# Altium schematic sheet measurment_synth.SchDoc
size A4; SheetNumber: 4; SheetTotal: 7
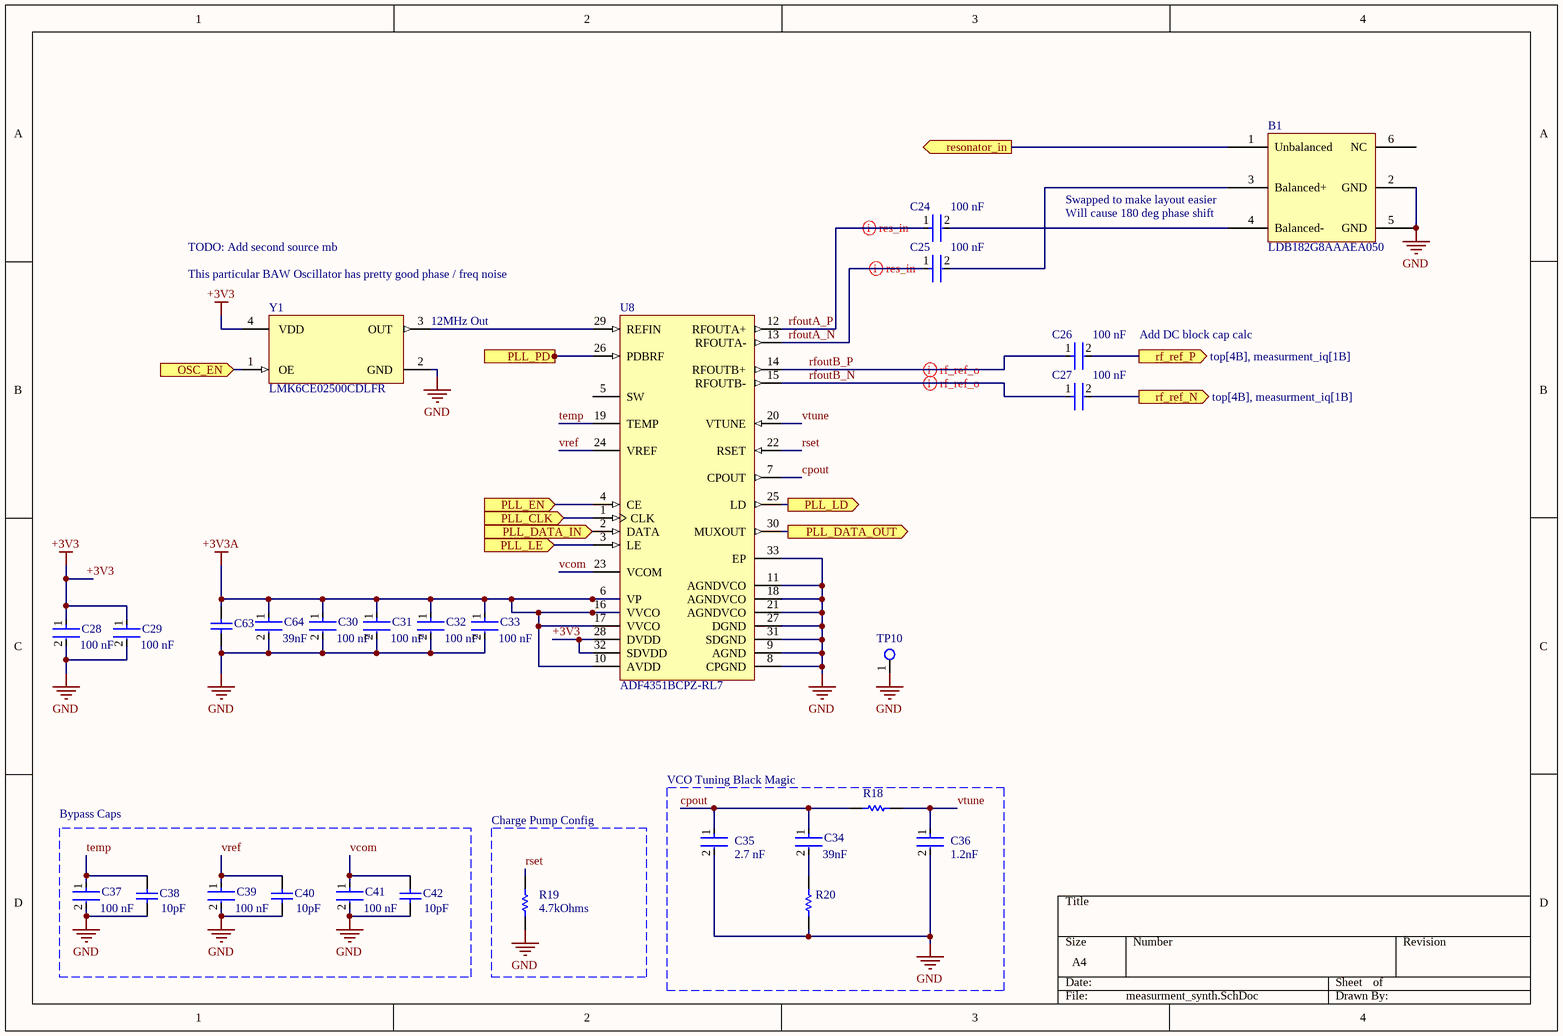
[diagram p0: measurment_synth.SchDoc]

## Parts
B1  LDB182G8AAAEA050  [Balum]
C24  Capacitance: 100 nF  [FP-CC0603-DA-MFG]  (hidden comment: CC0603KRX7R7BB104)
C25  Capacitance: 100 nF  [FP-CC0603-DA-MFG]  (hidden comment: CC0603KRX7R7BB104)
C26  Capacitance: 100 nF  [FP-CC0603-DA-MFG]  (hidden comment: CC0603KRX7R7BB104)
C27  Capacitance: 100 nF  [FP-CC0603-DA-MFG]  (hidden comment: CC0603KRX7R7BB104)
C28  Capacitance: 100 nF  [FP-CC0603-DA-MFG]  (hidden comment: CC0603KRX7R7BB104)
C29  Capacitance: 100 nF  [FP-CC0603-DA-MFG]  (hidden comment: CC0603KRX7R7BB104)
C30  Capacitance: 100 nF  [FP-CC0603-DA-MFG]  (hidden comment: CC0603KRX7R7BB104)
C31  Capacitance: 100 nF  [FP-CC0603-DA-MFG]  (hidden comment: CC0603KRX7R7BB104)
C32  Capacitance: 100 nF  [FP-CC0603-DA-MFG]  (hidden comment: CC0603KRX7R7BB104)
C33  Capacitance: 100 nF  [FP-CC0603-DA-MFG]  (hidden comment: CC0603KRX7R7BB104)
C34  Capacitance: 39nF  [FP-GCM155-0_05-IPC_B]  (hidden comment: GCM155R71C393KA37D)
C35  Capacitance: 2.7 nF  [FP-CC0402-MFG]  (hidden comment: CC0402KPX7R9BB272)
C36  Capacitance: 1.2nF  [FP-GCM188-0_1-IPC_A]  (hidden comment: GCM1885C1H122JA16J)
C37  Capacitance: 100 nF  [FP-CC0603-DA-MFG]  (hidden comment: CC0603KRX7R7BB104)
C38  Capacitance: 10pF  [CAPC1005X55X25ML05T05]  (hidden comment: CC0402JRNPO9BN100)
C39  Capacitance: 100 nF  [FP-CC0603-DA-MFG]  (hidden comment: CC0603KRX7R7BB104)
C40  Capacitance: 10pF  [CAPC1005X55X25ML05T05]  (hidden comment: CC0402JRNPO9BN100)
C41  Capacitance: 100 nF  [FP-CC0603-DA-MFG]  (hidden comment: CC0603KRX7R7BB104)
C42  Capacitance: 10pF  [CAPC1005X55X25ML05T05]  (hidden comment: CC0402JRNPO9BN100)
C63  GRM1555C1H270JA01D  [CAPC1005X55X25LL05T10]  (value not drawn)
C64  Capacitance: 39nF  [FP-GCM155-0_05-IPC_B]  (hidden comment: GCM155R71C393KA37D)
R18  RC0402JR-07680RL  [RESC1005X40X25LL05T10]  (value not drawn)
R19  Resistance: 4.7kOhms  [RESC1608X55X25LL10T15]  (hidden comment: RC0603FR-074K7L)
R20  RC0603JR-07360RL  [RESC1608X55X25ML10T15]  (value not drawn)
TP10  Test Point  [test_point]  (value not drawn)
U8  ADF4351BCPZ-RL7  [ADI-CP-32-2_L]
Y1  LMK6CE02500CDLFR  [DLF0004A_MFG]

## Blocks framed on the sheet
Bypass Caps: C37-C42
Charge Pump Config: R19
VCO Tuning Black Magic: C34-C36 R18 R20

## Ports
OSC_EN (in, see top[3B], mcu[3B]), PLL_CLK (in, see top[3B], mcu[3C]), PLL_DATA_IN (in, see top[3B], mcu[3C]), PLL_DATA_OUT (out, see top[3B], mcu[3C]), PLL_EN (in, see top[3B], mcu[3C]), PLL_LD (out, see top[3B], mcu[3C]), PLL_LE (in, see top[3B], mcu[3C]), PLL_PD (in, see top[3B], mcu[3C]), resonator_in (out, see top[4B]), rf_ref_N (out, see top[4B], measurment_iq[1B]), rf_ref_P (out, see top[4B], measurment_iq[1B])

## Nets
+3V3: C28.1 C29.1 U8.28(DVDD) U8.32(SDVDD) Y1.4(VDD)
+3V3A: C30.1 C31.1 C32.1 C33.1 C63.2 C64.1 U8.6(VP) U8.10(AVDD) U8.16(VVCO) U8.17(VVCO)
GND: B1.2(GND) B1.5(GND) C28.2 C29.2 C30.2 C31.2 C32.2 C33.2 C35.2 C36.2 C37.2 C38.1 C39.2 C40.1 C41.2 C42.1 C63.1 C64.2 R19.1 R20.1 TP10.1 U8.8(CPGND) U8.9(AGND) U8.11(AGNDVCO) U8.18(AGNDVCO) U8.21(AGNDVCO) U8.27(DGND) U8.31(SDGND) U8.33(EP) Y1.2(GND)
cpout: C34.1 C35.1 R18.1 U8.7(CPOUT)
OSC_EN: Y1.1(OE) ; port OSC_EN
PLL_CLK: U8.1(CLK) ; port PLL_CLK
PLL_DATA_IN: U8.2(DATA) ; port PLL_DATA_IN
PLL_DATA_OUT: U8.30(MUXOUT) ; port PLL_DATA_OUT
PLL_EN: U8.4(CE) ; port PLL_EN
PLL_LD: U8.25(LD) ; port PLL_LD
PLL_LE: U8.3(LE) ; port PLL_LE
PLL_PD: U8.26(PDBRF) ; port PLL_PD
resonator_in: B1.1(Unbalanced) ; port resonator_in
rf_ref_N: C27.2 ; port rf_ref_N
rf_ref_P: C26.2 ; port rf_ref_P
rfoutA_N: C25.1 U8.13(RFOUTA-)
rfoutA_P: C24.1 U8.12(RFOUTA+)
rfoutB_N: C27.1 U8.15(RFOUTB-)
rfoutB_P: C26.1 U8.14(RFOUTB+)
rset: R19.2 U8.22(RSET)
temp: C37.1 C38.2 U8.19(TEMP)
vcom: C41.1 C42.2 U8.23(VCOM)
vref: C39.1 C40.2 U8.24(VREF)
vtune: C36.1 R18.2 U8.20(VTUNE)
NetB1_3: B1.3(Balanced+) C25.2
NetB1_4: B1.4(Balanced-) C24.2
NetC34_2: C34.2 R20.2
NetU8_29: U8.29(REFIN) Y1.3(OUT)

Not connected (* = marked no-connect by the designer): B1 6(NC); U8 5(SW)

## Layout directives
differential pair: rfoutA_N, rfoutA_P, rfoutB_N, rfoutB_P

## Notes on the sheet
- TODO: Add second source mb
- (near B1) Swapped to make layout easier
- (near B1) Will cause 180 deg phase shift
- This particular BAW Oscillator has pretty good phase / freq noise
- (near Y1) 12MHz Out
- Add DC block cap calc

## Library data of the parts
C24-C33 C37 C39 C41 = CMP-2000-05002-2: CAP CER 0.1UF 16V X7R 0603; Manufacturer: YAGEO; Tolerance: 0.1; Value: 100 nF; Temperature Coefficient: 15%; Material: Ceramic; Voltage Rating: 16 V; Package: CC0603-DA; ComponentLink2Description: Datasheet; Octopart: https://octopart.com/cc0603krx7r7bb104-yageo-192941; Temperature Range High: +125°C; Digikey Description: CAP CER 0.1UF 16V X7R 0603; Voltage: 16 V; Device Class L2: Capacitors; Height: 0.9mm; Temperature: -55°C to +125°C; Manufacturer Part Number: CC0603KRX7R7BB104; Device Class L1: Passive Components; Device Class L3: Ceramic Capacitors; ComponentLink2URL: http://www.yageo.com/documents/recent/UPY-GPHC_X7R_6.3V-to-50V_18.pdf; Footprint Url: http://www.yageo.com/exep/pages/download/literatures/UPY-C_GEN_24.pdf; RoHS: TRUE; Temperature Range Low: -55°C; Temperature Characteristic: X7R; Lead Free: Yes; Category: Cap; Mouser Description: Multilayer Ceramic Capacitor, CC Series, 0.1 - F, - 10%, X7R, 16 V, 0603 [1608 Metric]; Automotive: No
C34 C64 = CMP-06035-054841-1: Ceramic Capacitor for Automotive 39nF ±10% 16VDC X7R 0402 Paper T/R; Voltage Rating: 16V; Max Operating Temperature: 125°C; Case Code (Imperial): 0402; Mount: Surface Mount; Packaging: Cut Tape; Tolerance: 10%; Min Operating Temperature: -55°C; Ratings: AEC-Q200; Case Code (Metric): 1005; Case/Package: 0402
C35 = CMP-03422-000661-1: CC0402 2.7 nF X7R 10.00% 50 V; Manufacturer: YAGEO; Material: Ceramic; Automotive Grade: NA; Voltage Rating: 50 V; Value: 2.7 nF; Temperature Coefficient: 30ppm/°C; Tolerance: 0.1; Temperature Range Low: -55°C; Manufacturer Part Number: CC0402KPX7R9BB272; Temperature Range High: +125°C; Package: CC0402; Temperature: -55°C to +125°C; ComponentLink2Description: Datasheet; Temperature Characteristic: X7R; Lead Free: Yes; Footprint Url: http://www.yageo.com/exep/pages/download/literatures/UPY-C_GEN_24.pdf; Device Class L3: Ceramic Capacitors; RoHS: TRUE; Automotive: No; Category: Cap; Device Class L2: Capacitors; ComponentLink2URL: http://www.yageo.com/documents/recent/UPY-GP_NP0_16V-to-50V_16.pdf; Device Class L1: Passive Components; Octopart: https://octopart.com/cc0402kpx7r9bb272-yageo-84795372; Height: 0.55mm; Ipc Land Pattern Name: CAPC10050X50
C36 = CMP-06035-017544-1: Ceramic Capacitor for Automotive 1.2nF  ±5% 50VDC C0G 0603 Paper T/R; Voltage Rating: 50V; Ratings: AEC-Q200; Dielectric: C0G; Width: 0.031inch; Max Operating Temperature: 125°C; Mount: Surface Mount; Height: 0.8mm; Min Operating Temperature: -55°C; Packaging: Tape and Reel; Thickness: 0.035inch; Case/Package: 0603; Package Quantity: 10000; Weight: 0.000222oz; Case Code (Metric): 1608; Tolerance: 5%; Case Code (Imperial): 0603; Voltage Rating (DC): 50V; Termination: SMD/SMT; Length: 0.063inch
C38 C40 C42 = CMP-2100-03589-1: Chip Capacitor, 10 pF, +/- 5%, 50 V, -55 to 125 degC, 0402 (1005 Metric), RoHS, Tape and Reel; Manufacturer: Yageo; Insulation Resistance: 100GR; Voltage Rating (DC): 50V; Dielectric Material: Ceramic; Temperature Coefficient: 30ppm/degC; Dielectric: C0G; Termination: SMD/SMT; Package Reference: 0402; Lead Free: LeadFree; Composition: Ceramic; Tolerance: 5%; Case Code (Metric): 1005; Voltage Rating: 50V; Packaging: TapeandReel; Manufacturer URL: http://www.yageo.com/; REACH SVHC: NoSVHC; Max Operating Temperature: 125degC; Length: 1mm; Mount: SurfaceMount; Depth: 0.5mm; Min Operating Temperature: -55degC; Number of Pins: 2; Width: 0.02inch; Datasheet Version: Rev. 14, 07/2016; Package Quantity: 1; Datasheet URL: http://www.yageo.com/documents/recent/UPY-GP_NP0_16V-to-50V_14.pdf; Case Code (Imperial): 0402; RoHSCompliant: True; Radiation Hardening: No; Height: 0.5mm; Case/Package: 0402; Thickness: 0.022inch; Package Description: 2-Pin Surface Mount Device, Body 1 x 0.5 mm; Voltage: 50V
C63 = CMP-2008-03917-1: Manufacturer: Murata; Part Number: GRM1555C1H270JA01D
R18 = CMP-2002-08032-1: Manufacturer: Yageo / Phycomp; Part Number: RC0402JR-07680RL
R19 = CMP-2000-06942-1: Chip Resistor, 4.7 KOhm, +/- 1%, 0.1 W, -55 to 155 degC, 0603 (1608 Metric), RoHS, Tape and Reel; Manufacturer: Yageo; Power Rating: 100mW; Temperature Coefficient: 100PPM/C; Voltage Rating: 50V; Package Reference: 0603; Series: RC; Datasheet Version: Rev. 7, 05/2017; Packaging: Reel; Termination Style: SMD/SMT; Datasheet URL: http://www.yageo.com/documents/recent/PYu-RC_Group_51_RoHS_L_7.pdf; Manufacturer URL: http://www.yageo.com/; Package Description: 2-Pin Surface Mount Device, Body 1.6 x 0.8 mm; Case Code - mm: 1608; Case Code - in: 0603; Mounting Technology: SurfaceMount; Operating Temperature Range: -55Cto+155C; Tolerance: 1%; Product: ThickFilmResistorsGeneralPurpose
R20 = CMP-2000-04266-1: Manufacturer: Yageo; Part Number: RC0603JR-07360RL
U8 = CMP-0287-00015-1: Wideband Synthesizer with Integrated VCO, CP-32-2, Pb-Free, 1500 Reel; Max RF Input (MHz): 4.4GHz; RF Prescalers: 4/5,8/9; Max REFin (MHz): 250MHz; Frequency Range: 35MHz-4.4GHz; Norm Phase Noise (dBc/Hz): -221dBc; Supply Current: 110mA; Single/Dual: Single; PackageVersion: Jan-2005; ComponentLink3URL: http://www.analog.com/static/imported-files/packages/414143737956480539664569CP_32_2.pdf; PackageReference: CP-32-2; ComponentLink2URL: http://www.analog.com/static/imported-files/data_sheets/ADF4351.pdf; ComponentLink1URL: www.analog.com; ComponentLink1Description: Manufacturer URL; ComponentLink2Description: Datasheet; ComponentLink3Description: Package Specification; PackageDescription: 32-Lead Lead Frame Chip Scale Package [LFCSP_VQ]; DatasheetVersion: Rev. Pr D; Code_JEDEC: MO-220-VHHD-2
Y1 = CMP-00370-144810711-1: "LOW-JITTER, HIGH-PERFORMANCE, BU" 25 MHz LVCMOS Oscillator 1.8V Enable/Disable 4-VDFN; Manufacturer Lifecycle Status: ACTIVE; Load Capacitance: 30pF; Frequency: 25MHz; Max Junction Temperature (Tj): 125°C; Max Supply Voltage: 1.9V; Min Supply Voltage: 1.7V; Height: 1mm; Min Operating Temperature: -40°C; HelpURL: https://www.ti.com/lit/ds/symlink/lmk6c.pdf; ComponentLink1URL: http://ti.com; Number of Pins: 4; ComponentLink2Description: Datasheet URL; ComponentLink2URL: https://www.ti.com/lit/ds/symlink/lmk6c.pdf; Max Operating Temperature: 105°C; Thickness: 900µm; Ambient Temperature Range High: 105°C; Length: 2.5mm; ComponentLink1Description: Manufacturer's Website; Width: 2mm; Lifecycle Status: Production; RoHS: Compliant